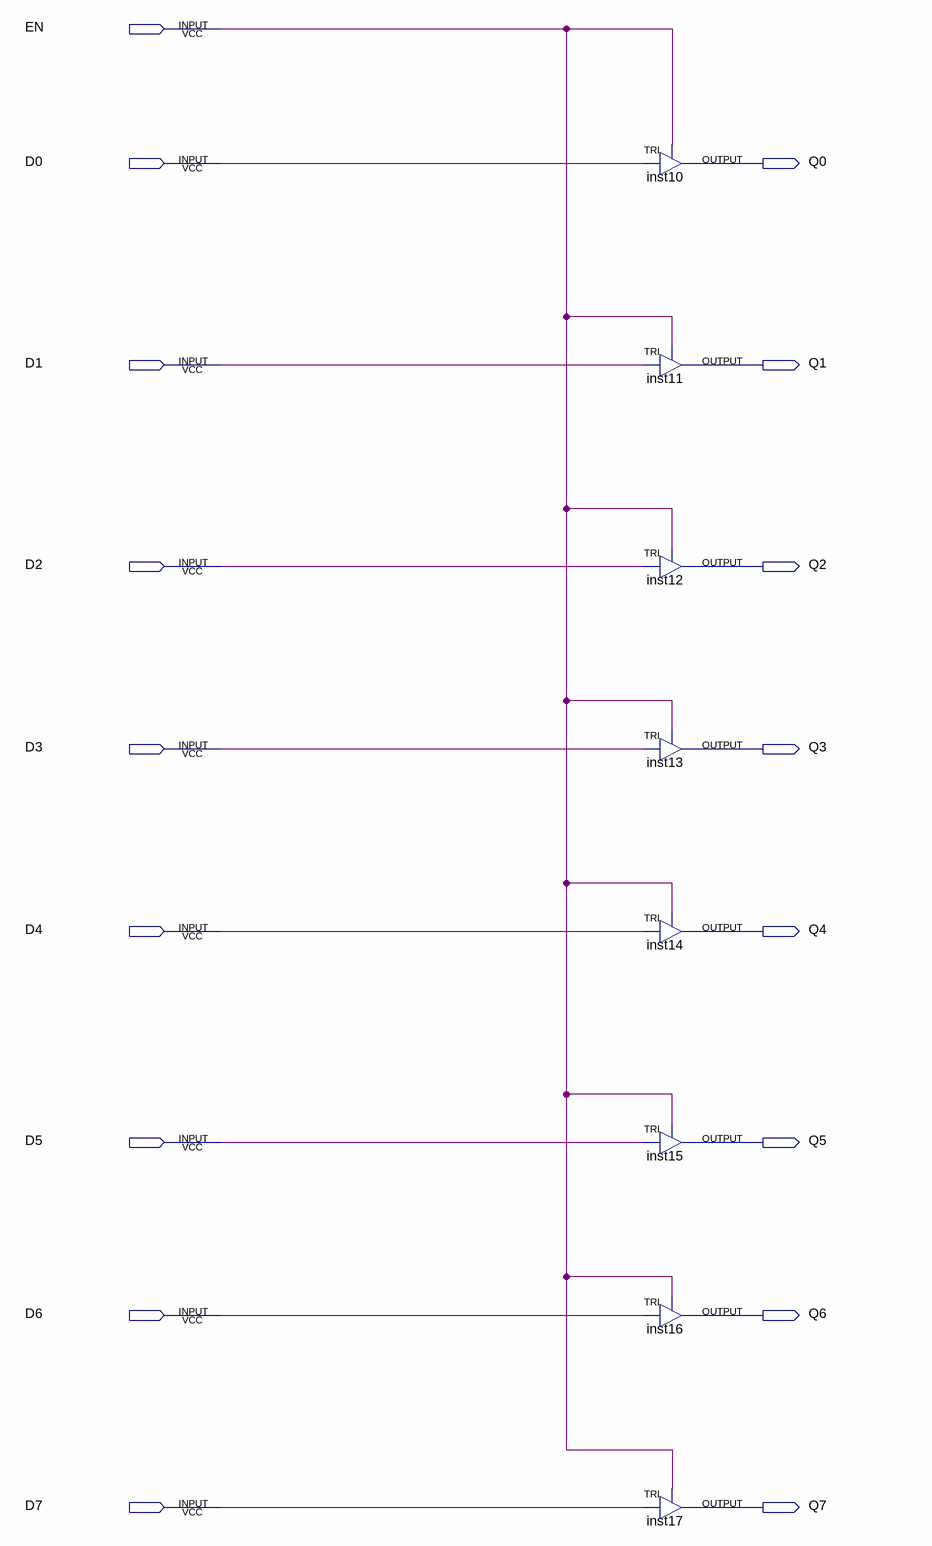
[diagram p0: schematic sheet]
// Quartus schematic THREE-STATE-ONE-GATE.bdf as structural Verilog: 8 symbols, 17 pins
module \THREE-STATE-ONE-GATE  (
  input  EN,
  input  D0,
  input  D1,
  input  D2,
  input  D3,
  input  D4,
  input  D5,
  input  D6,
  input  D7,
  output Q0,
  output Q1,
  output Q2,
  output Q3,
  output Q4,
  output Q5,
  output Q6,
  output Q7
);

  TRI inst10 (.IN(D0), .OE(EN), .OUT(Q0));
  TRI inst11 (.IN(D1), .OE(EN), .OUT(Q1));
  TRI inst12 (.IN(D2), .OE(EN), .OUT(Q2));
  TRI inst13 (.IN(D3), .OE(EN), .OUT(Q3));
  TRI inst14 (.IN(D4), .OE(EN), .OUT(Q4));
  TRI inst15 (.IN(D5), .OE(EN), .OUT(Q5));
  TRI inst16 (.IN(D6), .OE(EN), .OUT(Q6));
  TRI inst17 (.IN(D7), .OE(EN), .OUT(Q7));
endmodule
